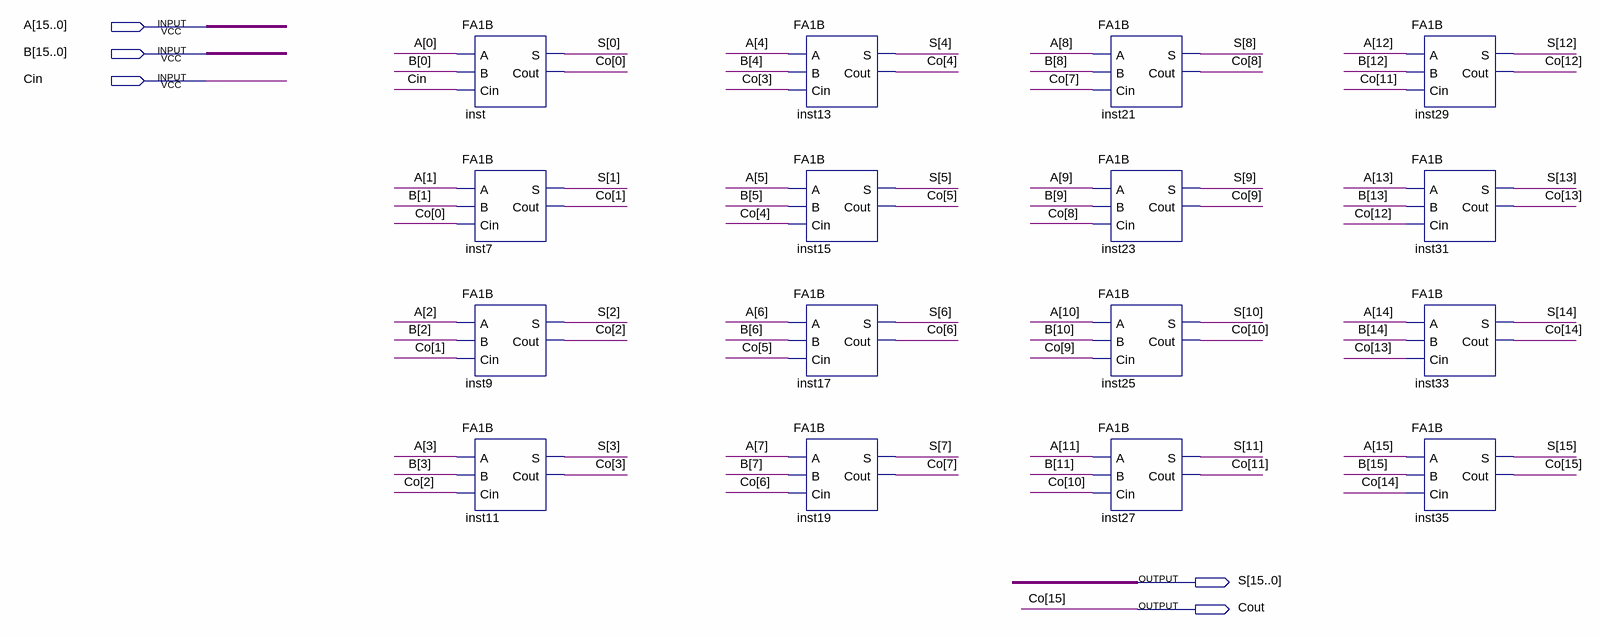
[diagram p0: schematic sheet]
// Quartus schematic FA16bit.bdf as structural Verilog: 16 symbols, 5 pins
module FA16bit (
  input  [15:0] A,
  input  [15:0] B,
  input  Cin,
  output [15:0] S,
  output Cout
);

  wire [14:0] Co;

  FA1B inst (.A(A[0]), .B(B[0]), .Cin(Cin), .S(S[0]), .Cout(Co[0]));
  FA1B inst7 (.A(A[1]), .B(B[1]), .Cin(Co[0]), .S(S[1]), .Cout(Co[1]));
  FA1B inst9 (.A(A[2]), .B(B[2]), .Cin(Co[1]), .S(S[2]), .Cout(Co[2]));
  FA1B inst11 (.A(A[3]), .B(B[3]), .Cin(Co[2]), .S(S[3]), .Cout(Co[3]));
  FA1B inst13 (.A(A[4]), .B(B[4]), .Cin(Co[3]), .S(S[4]), .Cout(Co[4]));
  FA1B inst15 (.A(A[5]), .B(B[5]), .Cin(Co[4]), .S(S[5]), .Cout(Co[5]));
  FA1B inst17 (.A(A[6]), .B(B[6]), .Cin(Co[5]), .S(S[6]), .Cout(Co[6]));
  FA1B inst19 (.A(A[7]), .B(B[7]), .Cin(Co[6]), .S(S[7]), .Cout(Co[7]));
  FA1B inst21 (.A(A[8]), .B(B[8]), .Cin(Co[7]), .S(S[8]), .Cout(Co[8]));
  FA1B inst23 (.A(A[9]), .B(B[9]), .Cin(Co[8]), .S(S[9]), .Cout(Co[9]));
  FA1B inst25 (.A(A[10]), .B(B[10]), .Cin(Co[9]), .S(S[10]), .Cout(Co[10]));
  FA1B inst27 (.A(A[11]), .B(B[11]), .Cin(Co[10]), .S(S[11]), .Cout(Co[11]));
  FA1B inst29 (.A(A[12]), .B(B[12]), .Cin(Co[11]), .S(S[12]), .Cout(Co[12]));
  FA1B inst31 (.A(A[13]), .B(B[13]), .Cin(Co[12]), .S(S[13]), .Cout(Co[13]));
  FA1B inst33 (.A(A[14]), .B(B[14]), .Cin(Co[13]), .S(S[14]), .Cout(Co[14]));
  FA1B inst35 (.A(A[15]), .B(B[15]), .Cin(Co[14]), .S(S[15]), .Cout(Cout));

  // Other names for the same wires on the sheet: Co[15] = Cout
endmodule
